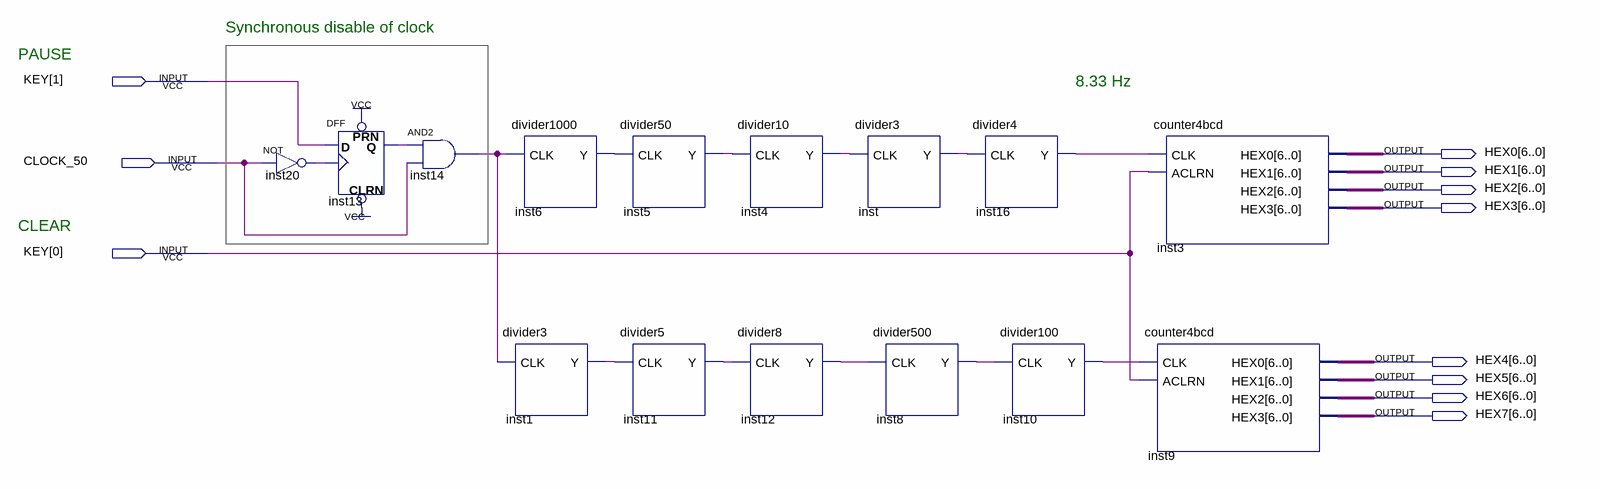
[diagram p0: schematic sheet]
// Quartus schematic test_dividers.bdf as structural Verilog: 15 symbols, 11 pins
module test_dividers (
  input  [1:0] KEY,
  input  CLOCK_50,
  output [6:0] HEX0,
  output [6:0] HEX1,
  output [6:0] HEX2,
  output [6:0] HEX3,
  output [6:0] HEX4,
  output [6:0] HEX5,
  output [6:0] HEX6,
  output [6:0] HEX7
);

  wire inst1_y, inst4_y, inst5_y, inst6_y, inst8_y, inst10_y, inst11_y, inst12_y, inst13_q, inst14_out,
       inst16_y, inst20_out, inst_y;

  not inst20 (inst20_out, CLOCK_50);
  DFF inst13 (.CLRN(1'b1), .CLK(inst20_out), .D(KEY[1]), .PRN(1'b1), .Q(inst13_q));
  and inst14 (inst14_out, inst13_q, CLOCK_50);
  divider1000 inst6 (.CLK(inst14_out), .Y(inst6_y));
  divider3 inst1 (.CLK(inst14_out), .Y(inst1_y));
  divider50 inst5 (.CLK(inst6_y), .Y(inst5_y));
  divider5 inst11 (.CLK(inst1_y), .Y(inst11_y));
  divider10 inst4 (.CLK(inst5_y), .Y(inst4_y));
  divider8 inst12 (.CLK(inst11_y), .Y(inst12_y));
  divider3 inst (.CLK(inst4_y), .Y(inst_y));
  divider500 inst8 (.CLK(inst12_y), .Y(inst8_y));
  divider4 inst16 (.CLK(inst_y), .Y(inst16_y));
  divider100 inst10 (.CLK(inst8_y), .Y(inst10_y));
  counter4bcd inst3 (.CLK(inst16_y), .ACLRN(KEY[0]), .HEX0(HEX0), .HEX1(HEX1), .HEX2(HEX2), .HEX3(HEX3));
  counter4bcd inst9 (.CLK(inst10_y), .ACLRN(KEY[0]), .HEX0(HEX4), .HEX1(HEX5), .HEX2(HEX6), .HEX3(HEX7));

  // Notes on the sheet:
  //   Synchronous disable of clock
  //   PAUSE
  //   8.33 Hz
  //   CLEAR
endmodule
